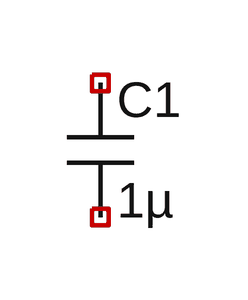
[diagram p0: schematic 19 - Micro bug and units.asc]
19 - Micro bug and units.asc, the LTspice schematic file:
Version 4.1
SHEET 1 880 680
SYMBOL cap -640 448 R0
SYMATTR InstName C1
SYMATTR Value 1µ

The netlist it stands for:
* 19 - Micro bug and units.asc
C1 NC_01 NC_02 1µ
.backanno
.end